# Altium project STM32F407IGH6BGA.PrjPcb
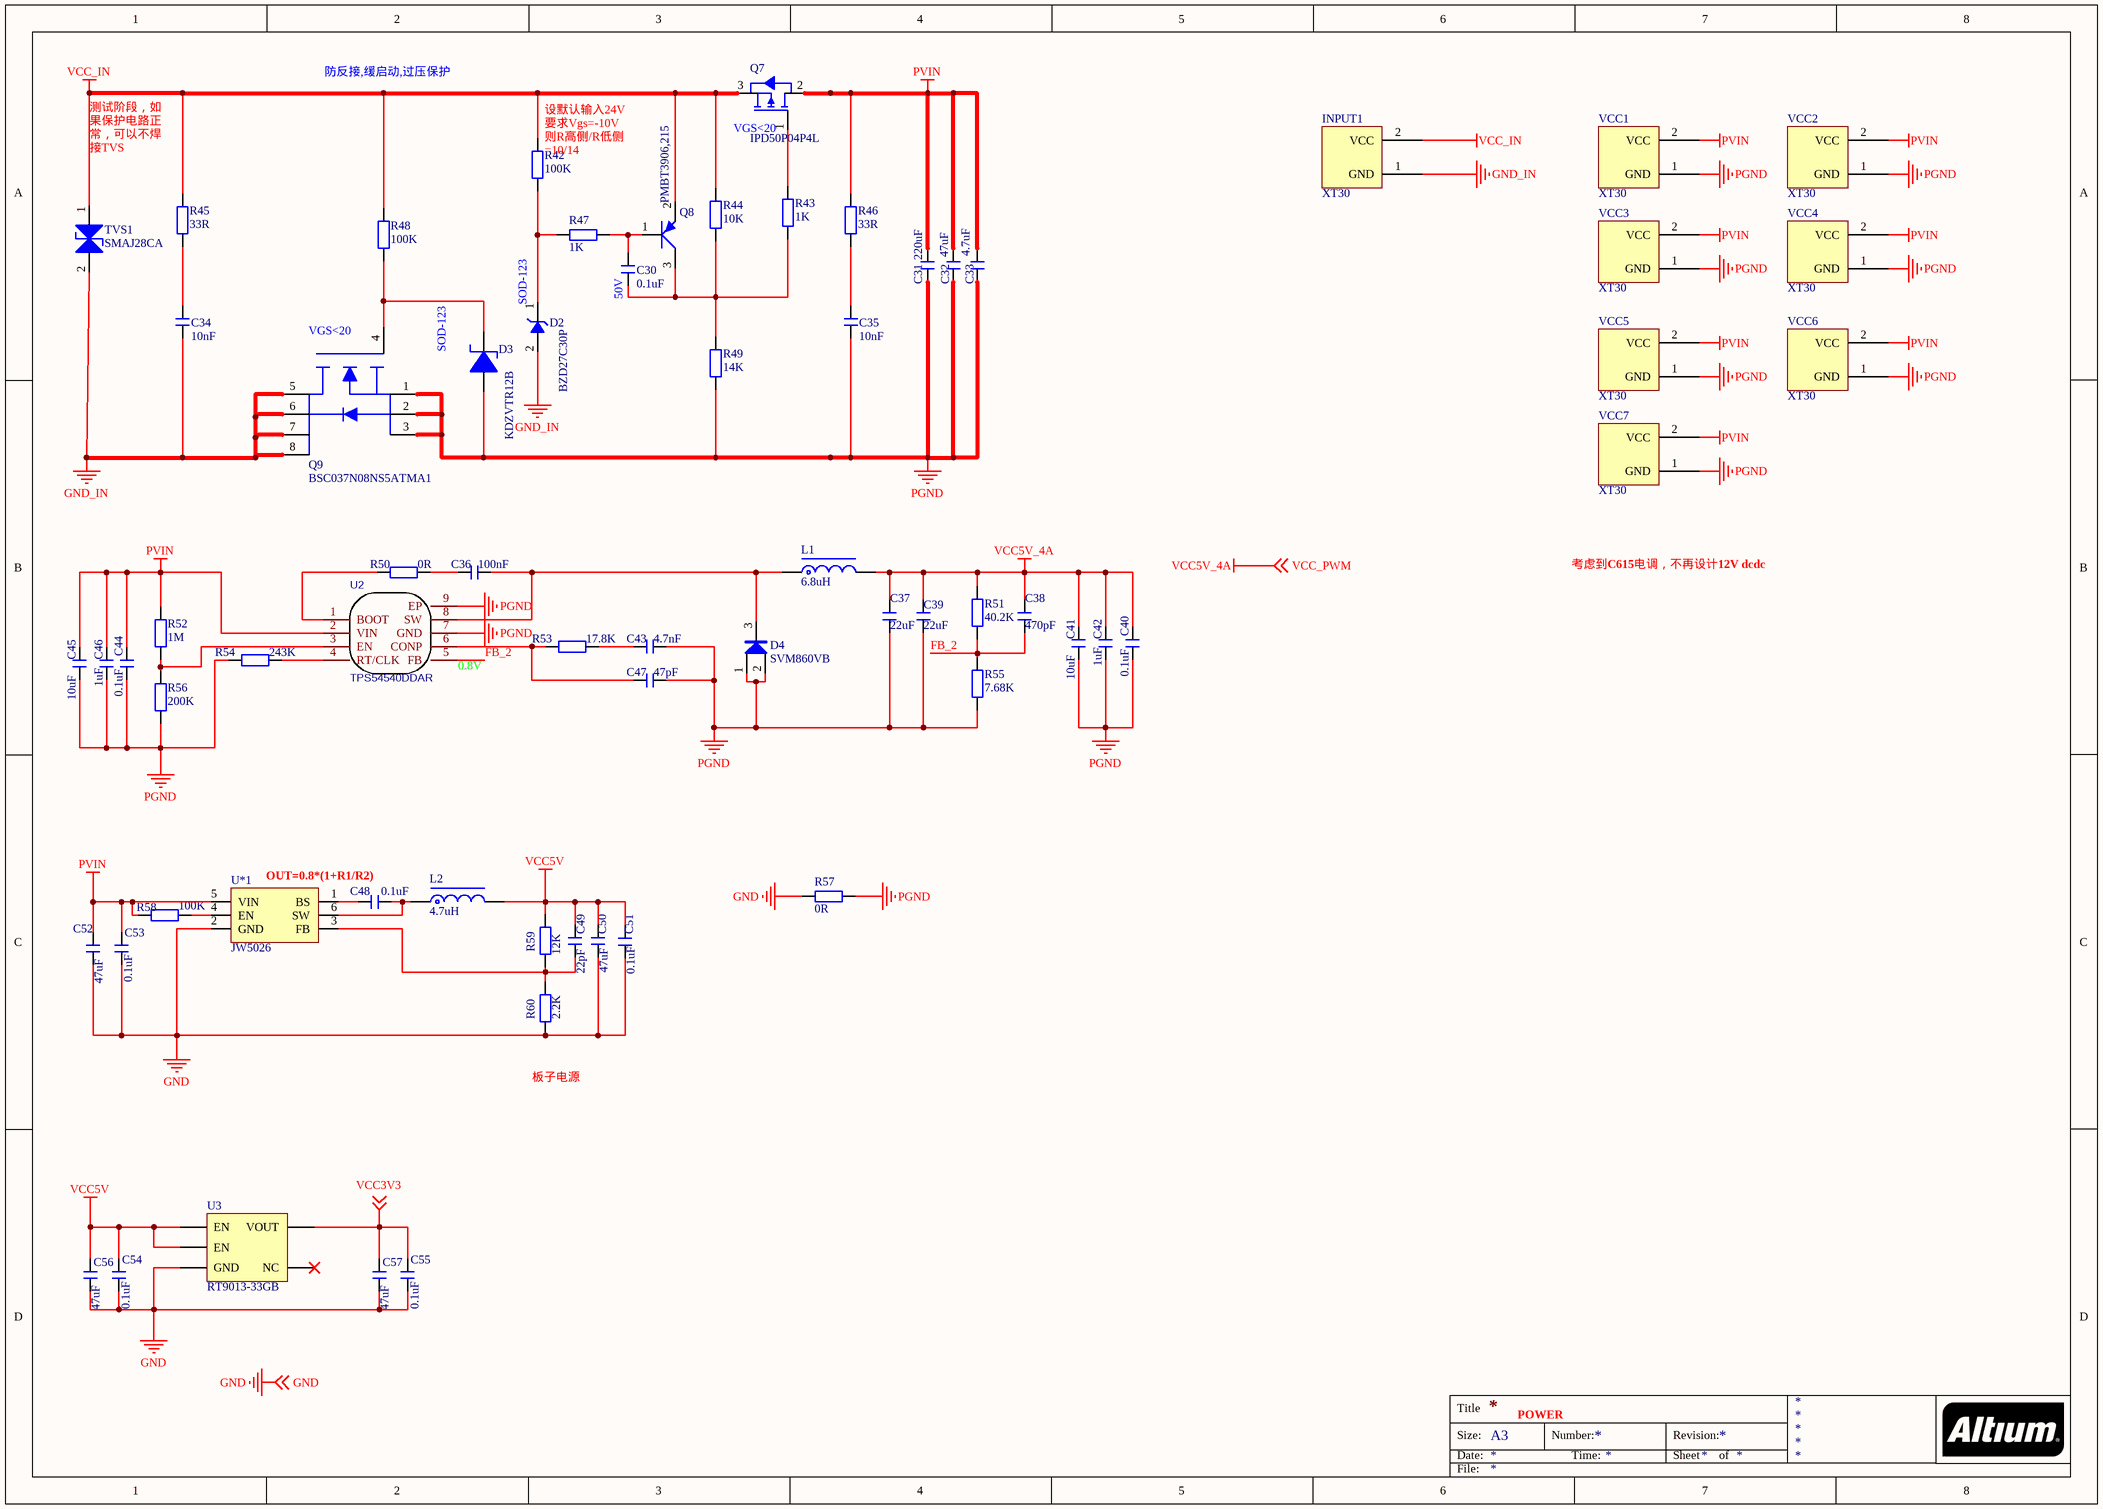
[diagram p0: Power.SchDoc]
3 sheets, 197 parts. Net scope: global (net labels, ports and power ports of the same name join across sheets).
Board file: STM32F407IGH6BGA.PcbDoc
Sheets:
  Power.SchDoc
  STM32F407IGH6BGA.SchDoc
  BasicPeripherals.SchDoc

## Sheet Power.SchDoc
size A3

### Parts
C30  0.1uF  [C 0603_L]
C31  220uF  [C 1206_L]
C32  47uF  [C 1206_L]
C33  4.7uF  [C 1206_L]
C34  10nF  [C 0603_L]
C35  10nF  [C 0603_L]
C36  100nF  [C 0603_L]
C37  22uF  [C 0805_L]
C38  470pF  [C 0603_L]
C39  22uF  [C 0805_L]
C40  0.1uF  [C 0805_L]
C41  10uF  [C 0805_L]
C42  1uF  [C 0805_L]
C43  4.7nF  [C 0603_L]
C44  0.1uF  [C 0805_L]
C45  10uF  [C 0805_L]
C46  1uF  [C 0805_L]
C47  47pF  [C 0603_L]
C48  0.1uF  [C 0603_L]
C49  22pF  [C 0603_L]
C50  47uF  [C 0805_L]
C51  0.1uF  [C 0805_L]
C52  47uF  [C 0805_L]
C53  0.1uF  [C 0805_L]
C54  0.1uF  [C 0805_L]
C55  0.1uF  [C 0805_L]
C56  47uF  [C 0805_L]
C57  47uF  [C 0805_L]
D2  BZD27C30P  [SOD-123_L2.8-W1.8-LS3.7-RD]
D3  KDZVTR12B  [SOD-123_L2.8-W1.8-LS3.7-RD]
D4  SVM860VB  [TO-277B_3P-L6.1-W4.3-LS7.0-BR]
INPUT1  XT30  [XT30PW-M]
L1  6.8uH  [CDRH73]
L2  4.7uH  [CD53]
Q7  IPD50P04P4L  [PG-TO252-3]
Q8  PMBT3906,215  [SOT-23-3_L2.9-W1.3-P1.90-LS2.4-BR]
Q9  BSC037N08NS5ATMA1  [PG-TDSON-8_L5.0-W6.0-P1.27-LS6.2-BL-EP]
R42  100K  [R 0603_L]
R43  1K  [R 0603_L]
R44  10K  [R 0603_L]
R45  33R  [R 0603_L]
R46  33R  [R 0603_L]
R47  1K  [R 0603_L]
R48  100K  [R 0603_L]
R49  14K  [R 0603_L]
R50  0R  [R 0603_L]
R51  40.2K  [R 0603_L]
R52  1M  [R 0603_L]
R53  17.8K  [R 0603_L]
R54  243K  [R 0603_L]
R55  7.68K  [R 0603_L]
R56  200K  [R 0603_L]
R57  0R  [R 0603_L]
R58  100K  [R 0603_L]
R59  12K  [R 0603_L]
R60  2.2K  [R 0603_L]
TVS1  SMAJ28CA  [SMA(DO-214AC)]
U2  TPS54540DDAR  [TPS54540]
U3  RT9013-33GB  [SOT23-5M]
U*1  JW5026  [SOT-23-6_L2.9-W1.6-P0.95-LS2.8-BL]
VCC1  XT30  [XT30UPB-F]
VCC2  XT30  [XT30UPB-F]
VCC3  XT30  [XT30UPB-F]
VCC4  XT30  [XT30UPB-F]
VCC5  XT30  [XT30UPB-F]
VCC6  XT30  [XT30UPB-F]
VCC7  XT30  [XT30UPB-F]

### Nets
GND: C50.1 C51.1 C52.1 C53.1 C54.1 C55.1 C56.1 C57.1 R57.1 R60.1 U3.2(GND) U*1.2(GND) ; off-sheet GND
GND_IN: C34.1 D2.2 INPUT1.1(GND) Q9.5 Q9.6 Q9.7 Q9.8 TVS1.2
PGND: C31.1 C32.1 C33.1 C35.1 C37.1 C39.1 C40.1 C41.1 C42.1 C43.2 C44.1 C45.1 C46.1 C47.2 D3.2 D4.1(A) D4.2(K) Q9.1 Q9.2 Q9.3 R49.1 R54.2 R55.1 R56.1 R57.2 U2.7(GND) U2.9(EP) VCC1.1(GND) VCC2.1(GND) VCC3.1(GND) VCC4.1(GND) VCC5.1(GND) VCC6.1(GND) VCC7.1(GND)
PVIN: C31.2 C32.2 C33.2 C44.2 C45.2 C46.2 C52.2 C53.2 Q7.2 R46.2 R52.2 R58.2 U2.2(VIN) U*1.5(VIN) VCC1.2(VCC) VCC2.2(VCC) VCC3.2(VCC) VCC4.2(VCC) VCC5.2(VCC) VCC6.2(VCC) VCC7.2(VCC)
VCC3V3: C55.2 C57.2 U3.5(VOUT) ; off-sheet VCC3V3
VCC5V: C49.2 C50.2 C51.2 C54.2 C56.2 L2.2 R59.2 U3.1(EN) U3.3(EN)
VCC5V_4A: C37.2 C38.2 C39.2 C40.2 C41.2 C42.2 L1.2 R51.2 ; off-sheet VCC_PWM  [also labelled VCC_PWM]
VCC_IN: INPUT1.2(VCC) Q7.3 Q8.2 R42.2 R44.2 R45.2 R48.2 TVS1.1
FB_2: C38.1 R51.1 R55.2 U2.5(FB)
NetC30_1: C30.1 Q8.3 R43.1 R44.1 R49.2
NetC30_2: C30.2 Q8.1 R47.1
NetC34_2: C34.2 R45.1
NetC35_2: C35.2 R46.1
NetC36_1: C36.1 R50.1
NetC36_2: C36.2 D4.3 L1.1 U2.8(SW)
NetC43_1: C43.1 R53.1
NetC47_1: C47.1 R53.2 U2.6(CONP)
NetC48_1: C48.1 U*1.1(BS)
NetC48_2: C48.2 L2.1 U*1.6(SW)
NetC49_1: C49.1 R59.1 R60.2 U*1.3(FB)
NetD2_1: D2.1 R42.1 R47.2
NetD3_1: D3.1 Q9.4 R48.1
NetQ7_1: Q7.1 R43.2
NetR50_2: R50.2 U2.1(BOOT)
NetR52_1: R52.1 R56.2 U2.3(EN)
NetR54_1: R54.1 U2.4(RT/CLK)
NetR58_1: R58.1 U*1.4(EN)

Not connected (* = marked no-connect by the designer): U3 4(NC)*

### Notes on the sheet
- 防反接,缓启动,过压保护
- 测试阶段，如果保护电路正常，可以不焊接TVS
- (near R42) 设默认输入24V
  要求Vgs=-10V
  则R高侧/R低侧=10/14
- (near Q7) VGS<20
- (near D2) SOD-123
- (near C30) 50V
- (near Q9) VGS<20
- SOD-123
- 考虑到C615电调，不再设计12V dcdc
- (near U2) 0.8V
- OUT=0.8*(1+R1/R2)
- (near R60) 板子电源
- POWER
- Title
- Size:
- Date:
- A3
- Number:
- Time:
- Revision:
- Sheet
- of
- File:

### Library data of the parts
C30-C57 = C: 贴片电容
D4 = SVM860VB: TO-277B系列,SVM860VB-8A
L1 = L-CDRH: 功率屏蔽电感
L2 = L-SMD: CD系列贴片线绕功率电感
R42-R60 = R: 贴片电阻
U2 = TPS54540DDAR: BOM_Manufacturer: TI; SMT Type: Extend; BOM_Supplier: LCSC; BOM_Manufacturer Part: TPS54540DDAR; BOM_Supplier Part: C95286; BOM_LCSC Assembly: Yes; spicePre: U
U*1 = JW5026 : BUCK、MAX40V

## Sheet STM32F407IGH6BGA.SchDoc
size A3
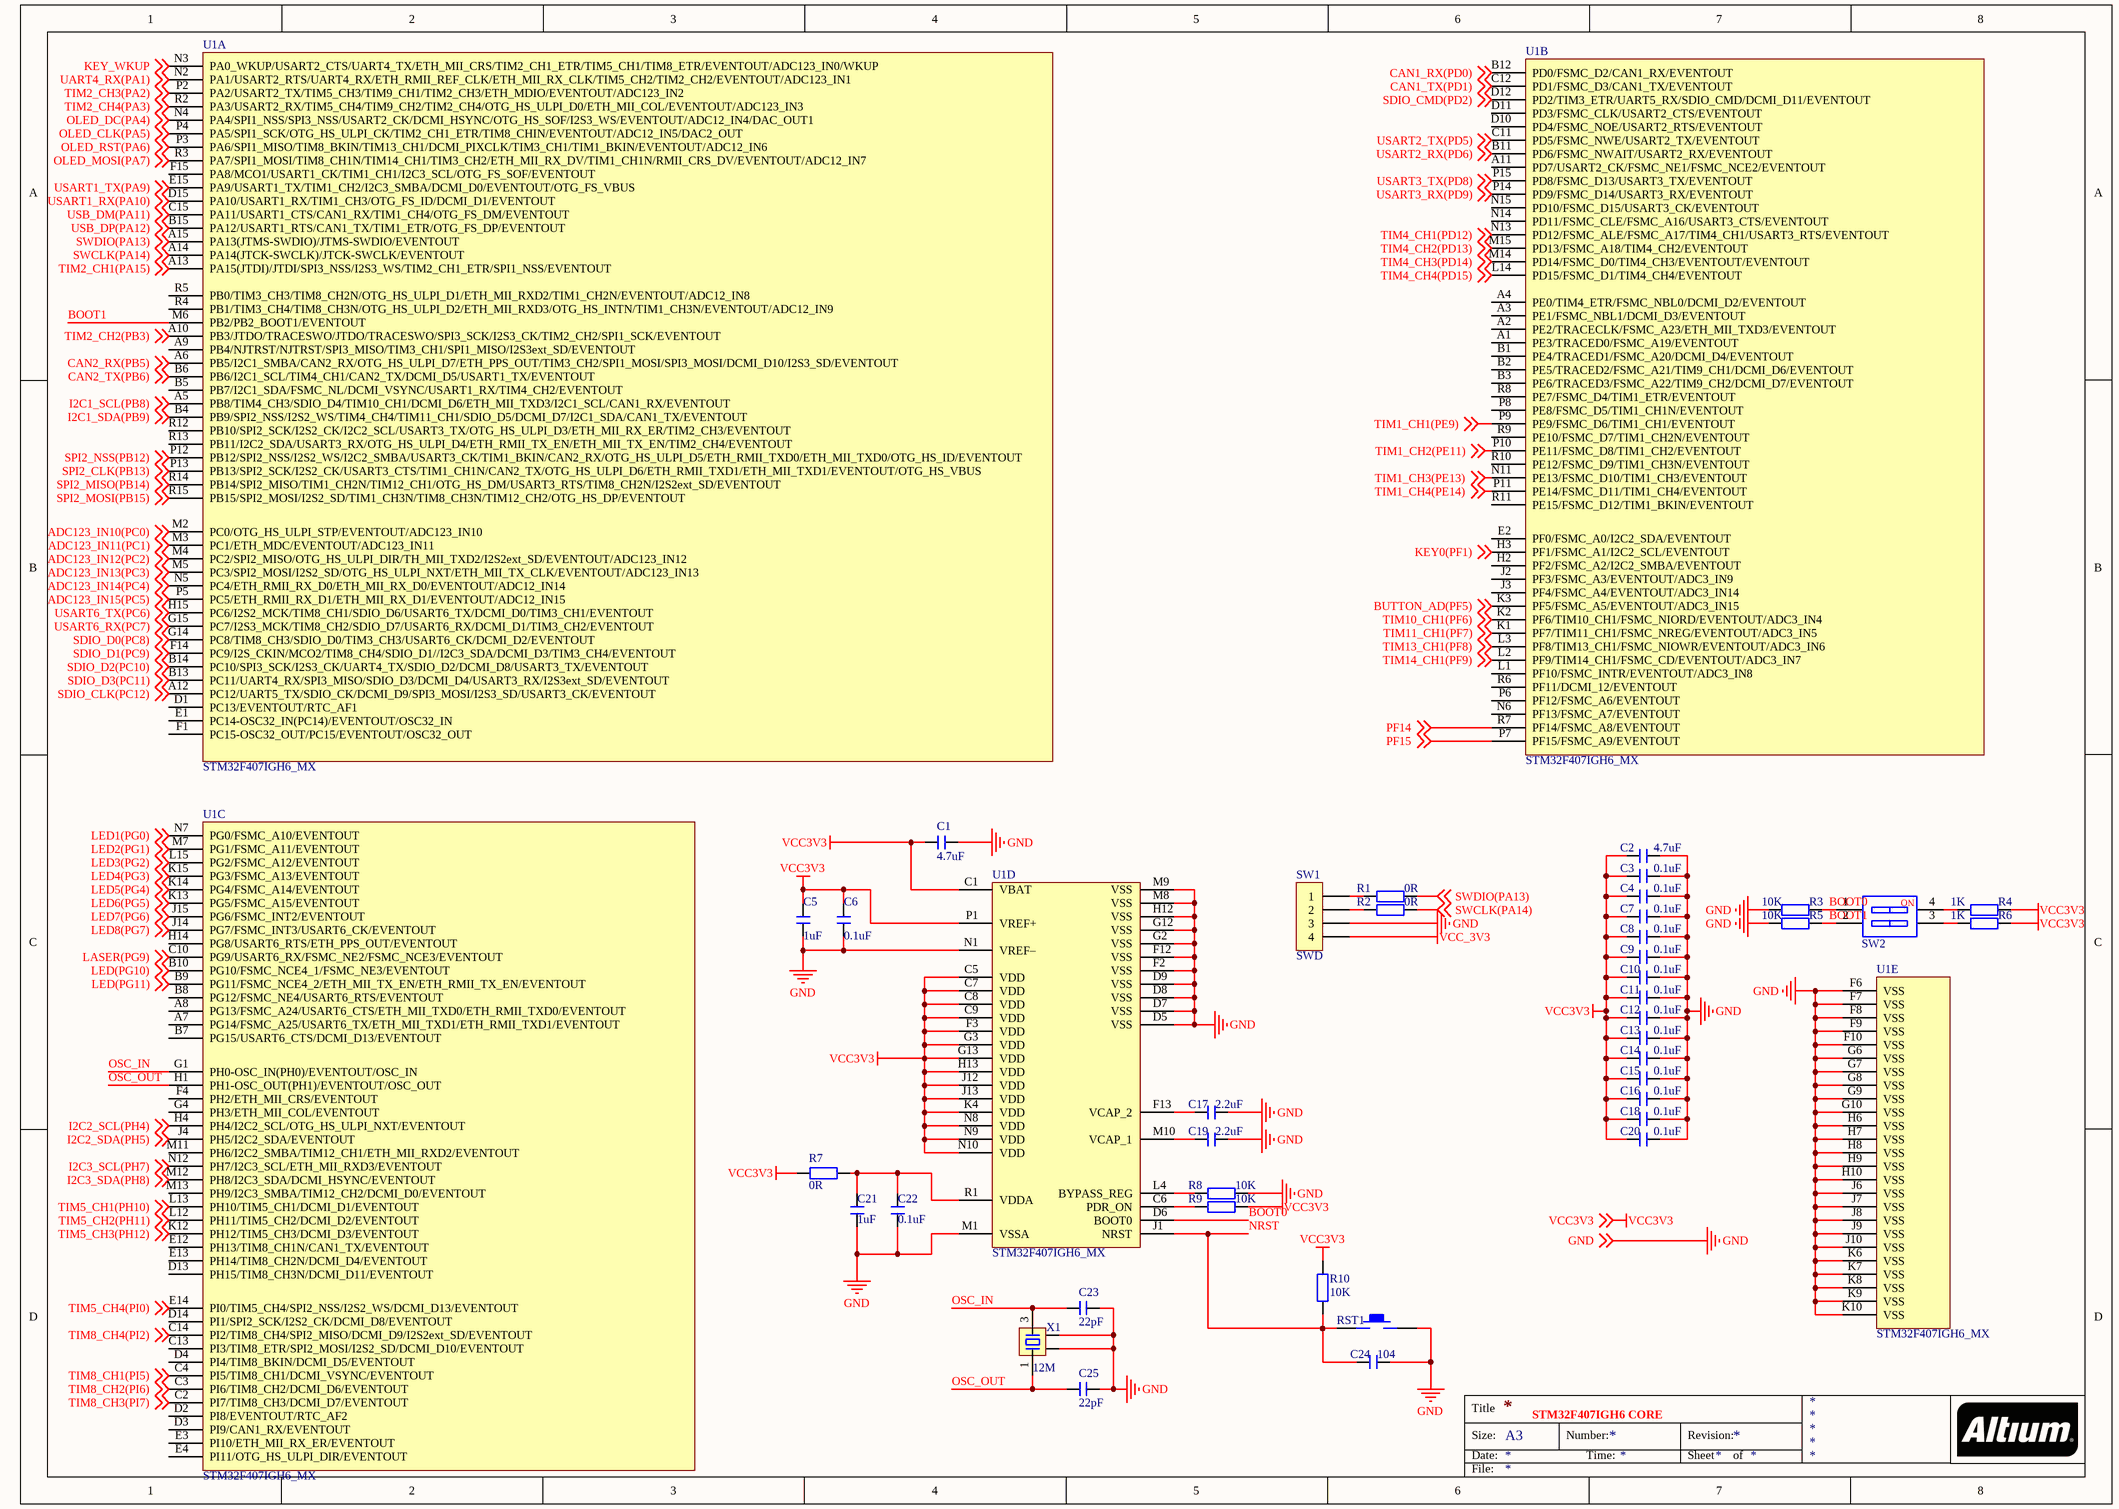
[diagram p1: STM32F407IGH6BGA.SchDoc]

### Parts
C1  4.7uF  [C 0402_M]
C2  4.7uF  [C 0402_M]
C3  0.1uF  [C 0402_M]
C4  0.1uF  [C 0402_M]
C5  1uF  [C 0402_M]
C6  0.1uF  [C 0402_M]
C7  0.1uF  [C 0402_M]
C8  0.1uF  [C 0402_M]
C9  0.1uF  [C 0402_M]
C10  0.1uF  [C 0402_M]
C11  0.1uF  [C 0402_M]
C12  0.1uF  [C 0402_M]
C13  0.1uF  [C 0402_M]
C14  0.1uF  [C 0402_M]
C15  0.1uF  [C 0402_M]
C16  0.1uF  [C 0402_M]
C17  2.2uF  [C 0402_M]
C18  0.1uF  [C 0402_M]
C19  2.2uF  [C 0402_M]
C20  0.1uF  [C 0402_M]
C21  1uF  [C 0402_M]
C22  0.1uF  [C 0402_M]
C23  22pF  [C 0402_M]
C24  104  [C 0402_M]
C25  22pF  [C 0402_M]
R1  0R  [R 0402_M]
R2  0R  [R 0402_M]
R3  10K  [R 0402_M]
R4  1K  [R 0402_M]
R5  10K  [R 0402_M]
R6  1K  [R 0402_M]
R7  0R  [R 0402_M]
R8  10K  [R 0402_M]
R9  10K  [R 0402_M]
R10  10K  [R 0402_M]
RST1  RST  [SMD-3.2*4.2]  (value not drawn)
SW1  SWD  [MX 1.25-WS-4P]
SW2  SW-2P  [CSW1.27 SMD-2P]  (value not drawn)
U1  STM32F407IGH6_MX  [UBGA-176+25]  (parts A,B,C,D,E of 5)
X1  12M  [OSC 3225-4P]

### Nets
GND: C1.1 C2.2 C3.2 C4.2 C5.1 C6.1 C7.2 C8.2 C9.2 C10.2 C11.2 C12.2 C13.2 C14.2 C15.2 C16.2 C17.2 C18.2 C19.2 C20.2 C21.1 C22.1 C23.2 C24.2 C25.2 R3.1 R5.1 R8.2 RST1.2 SW1.3 U1.D5(VSS) U1.D7(VSS) U1.D8(VSS) U1.D9(VSS) U1.F2(VSS) U1.F6(VSS) U1.F7(VSS) U1.F8(VSS) U1.F9(VSS) U1.F10(VSS) U1.F12(VSS) U1.G2(VSS) U1.G6(VSS) U1.G7(VSS) U1.G8(VSS) U1.G9(VSS) U1.G10(VSS) U1.G12(VSS) U1.H6(VSS) U1.H7(VSS) U1.H8(VSS) U1.H9(VSS) U1.H10(VSS) U1.H12(VSS) U1.J6(VSS) U1.J7(VSS) U1.J8(VSS) U1.J9(VSS) U1.J10(VSS) U1.K6(VSS) U1.K7(VSS) U1.K8(VSS) U1.K9(VSS) U1.K10(VSS) U1.M1(VSSA) U1.M8(VSS) U1.M9(VSS) U1.N1(VREF–) X1.2 X1.4 ; off-sheet GND
VCC3V3: C1.2 C2.1 C3.1 C4.1 C5.2 C6.2 C7.1 C8.1 C9.1 C10.1 C11.1 C12.1 C13.1 C14.1 C15.1 C16.1 C18.1 C20.1 R4.2 R6.2 R7.1 R9.2 R10.2 U1.C1(VBAT) U1.C5(VDD) U1.C7(VDD) U1.C8(VDD) U1.C9(VDD) U1.F3(VDD) U1.G3(VDD) U1.G13(VDD) U1.H13(VDD) U1.J12(VDD) U1.J13(VDD) U1.K4(VDD) U1.N8(VDD) U1.N9(VDD) U1.N10(VDD) U1.P1(VREF+) ; off-sheet VCC3V3
VCC_3V3: SW1.4
ADC123_IN10(PC0): U1.M2(PC0/OTG_HS_ULPI_STP/EVENTOUT/ADC123_IN10) ; off-sheet ADC123_IN10(PC0)
ADC123_IN11(PC1): U1.M3(PC1/ETH_MDC/EVENTOUT/ADC123_IN11) ; off-sheet ADC123_IN11(PC1)
ADC123_IN12(PC2): U1.M4(PC2/SPI2_MISO/OTG_HS_ULPI_DIR/TH_MII_TXD2/I2S2ext_SD/EVENTOUT/ADC123_IN12) ; off-sheet ADC123_IN12(PC2)
ADC123_IN13(PC3): U1.M5(PC3/SPI2_MOSI/I2S2_SD/OTG_HS_ULPI_NXT/ETH_MII_TX_CLK/EVENTOUT/ADC123_IN13) ; off-sheet ADC123_IN13(PC3)
ADC123_IN14(PC4): U1.N5(PC4/ETH_RMII_RX_D0/ETH_MII_RX_D0/EVENTOUT/ADC12_IN14) ; off-sheet ADC123_IN14(PC4)
ADC123_IN15(PC5): U1.P5(PC5/ETH_RMII_RX_D1/ETH_MII_RX_D1/EVENTOUT/ADC12_IN15) ; off-sheet ADC123_IN15(PC5)
BOOT0: R3.2 SW2.1 U1.D6(BOOT0)
BOOT1: R5.2 SW2.2 U1.M6(PB2/PB2_BOOT1/EVENTOUT)
BUTTON_AD(PF5): U1.K3(PF5/FSMC_A5/EVENTOUT/ADC3_IN15) ; off-sheet BUTTON_AD(PF5)
CAN1_RX(PD0): U1.B12(PD0/FSMC_D2/CAN1_RX/EVENTOUT) ; off-sheet CAN1_RX(PD0)
CAN1_TX(PD1): U1.C12(PD1/FSMC_D3/CAN1_TX/EVENTOUT) ; off-sheet CAN1_TX(PD1)
CAN2_RX(PB5): U1.A6(PB5/I2C1_SMBA/CAN2_RX/OTG_HS_ULPI_D7/ETH_PPS_OUT/TIM3_CH2/SPI1_MOSI/SPI3_MOSI/DCMI_D10/I2S3_SD/EVENTOUT) ; off-sheet CAN2_RX(PB5)
CAN2_TX(PB6): U1.B6(PB6/I2C1_SCL/TIM4_CH1/CAN2_TX/DCMI_D5/USART1_TX/EVENTOUT) ; off-sheet CAN2_TX(PB6)
I2C1_SCL(PB8): U1.A5(PB8/TIM4_CH3/SDIO_D4/TIM10_CH1/DCMI_D6/ETH_MII_TXD3/I2C1_SCL/CAN1_RX/EVENTOUT) ; off-sheet I2C1_SCL(PB8)
I2C1_SDA(PB9): U1.B4(PB9/SPI2_NSS/I2S2_WS/TIM4_CH4/TIM11_CH1/SDIO_D5/DCMI_D7/I2C1_SDA/CAN1_TX/EVENTOUT) ; off-sheet I2C1_SDA(PB9)
I2C2_SCL(PH4): U1.H4(PH4/I2C2_SCL/OTG_HS_ULPI_NXT/EVENTOUT) ; off-sheet I2C2_SCL(PH4)
I2C2_SDA(PH5): U1.J4(PH5/I2C2_SDA/EVENTOUT) ; off-sheet I2C2_SDA(PH5)
I2C3_SCL(PH7): U1.N12(PH7/I2C3_SCL/ETH_MII_RXD3/EVENTOUT) ; off-sheet I2C3_SCL(PH7)
I2C3_SDA(PH8): U1.M12(PH8/I2C3_SDA/DCMI_HSYNC/EVENTOUT) ; off-sheet I2C3_SDA(PH8)
KEY0(PF1): U1.H3(PF1/FSMC_A1/I2C2_SCL/EVENTOUT) ; off-sheet KEY0(PF1)
KEY_WKUP: U1.N3(PA0_WKUP/USART2_CTS/UART4_TX/ETH_MII_CRS/TIM2_CH1_ETR/TIM5_CH1/TIM8_ETR/EVENTOUT/ADC123_IN0/WKUP) ; off-sheet KEY_WKUP
LASER(PG9): U1.C10(PG9/USART6_RX/FSMC_NE2/FSMC_NCE3/EVENTOUT) ; off-sheet LASER(PG9)
LED1(PG0): U1.N7(PG0/FSMC_A10/EVENTOUT) ; off-sheet LED1(PG0)
LED2(PG1): U1.M7(PG1/FSMC_A11/EVENTOUT) ; off-sheet LED2(PG1)
LED3(PG2): U1.L15(PG2/FSMC_A12/EVENTOUT) ; off-sheet LED3(PG2)
LED4(PG3): U1.K15(PG3/FSMC_A13/EVENTOUT) ; off-sheet LED4(PG3)
LED5(PG4): U1.K14(PG4/FSMC_A14/EVENTOUT) ; off-sheet LED5(PG4)
LED6(PG5): U1.K13(PG5/FSMC_A15/EVENTOUT) ; off-sheet LED6(PG5)
LED7(PG6): U1.J15(PG6/FSMC_INT2/EVENTOUT) ; off-sheet LED7(PG6)
LED8(PG7): U1.J14(PG7/FSMC_INT3/USART6_CK/EVENTOUT) ; off-sheet LED8(PG7)
LED(PG10): U1.B10(PG10/FSMC_NCE4_1/FSMC_NE3/EVENTOUT) ; off-sheet LED(PG10)
LED(PG11): U1.B9(PG11/FSMC_NCE4_2/ETH_MII_TX_EN/ETH_RMII_TX_EN/EVENTOUT) ; off-sheet LED(PG11)
NRST: C24.1 R10.1 RST1.1 U1.J1(NRST)
OLED_CLK(PA5): U1.P4(PA5/SPI1_SCK/OTG_HS_ULPI_CK/TIM2_CH1_ETR/TIM8_CHIN/EVENTOUT/ADC12_IN5/DAC2_OUT) ; off-sheet OLED_CLK(PA5)
OLED_DC(PA4): U1.N4(PA4/SPI1_NSS/SPI3_NSS/USART2_CK/DCMI_HSYNC/OTG_HS_SOF/I2S3_WS/EVENTOUT/ADC12_IN4/DAC_OUT1) ; off-sheet OLED_DC(PA4)
OLED_MOSI(PA7): U1.R3(PA7/SPI1_MOSI/TIM8_CH1N/TIM14_CH1/TIM3_CH2/ETH_MII_RX_DV/TIM1_CH1N/RMII_CRS_DV/EVENTOUT/ADC12_IN7) ; off-sheet OLED_MOSI(PA7)
OLED_RST(PA6): U1.P3(PA6/SPI1_MISO/TIM8_BKIN/TIM13_CH1/DCMI_PIXCLK/TIM3_CH1/TIM1_BKIN/EVENTOUT/ADC12_IN6) ; off-sheet OLED_RST(PA6)
OSC_IN: C23.1 U1.G1(PH0-OSC_IN(PH0)/EVENTOUT/OSC_IN) X1.3
OSC_OUT: C25.1 U1.H1(PH1-OSC_OUT(PH1)/EVENTOUT/OSC_OUT) X1.1
PF14: U1.R7(PF14/FSMC_A8/EVENTOUT) ; off-sheet PF14
PF15: U1.P7(PF15/FSMC_A9/EVENTOUT) ; off-sheet PF15
SDIO_CLK(PC12): U1.A12(PC12/UART5_TX/SDIO_CK/DCMI_D9/SPI3_MOSI/I2S3_SD/USART3_CK/EVENTOUT) ; off-sheet SDIO_CLK(PC12)
SDIO_CMD(PD2): U1.D12(PD2/TIM3_ETR/UART5_RX/SDIO_CMD/DCMI_D11/EVENTOUT) ; off-sheet SDIO_CMD(PD2)
SDIO_D0(PC8): U1.G14(PC8/TIM8_CH3/SDIO_D0/TIM3_CH3/USART6_CK/DCMI_D2/EVENTOUT) ; off-sheet SDIO_D0(PC8)
SDIO_D1(PC9): U1.F14(PC9/I2S_CKIN/MCO2/TIM8_CH4/SDIO_D1//I2C3_SDA/DCMI_D3/TIM3_CH4/EVENTOUT) ; off-sheet SDIO_D1(PC9)
SDIO_D2(PC10): U1.B14(PC10/SPI3_SCK/I2S3_CK/UART4_TX/SDIO_D2/DCMI_D8/USART3_TX/EVENTOUT) ; off-sheet SDIO_D2(PC10)
SDIO_D3(PC11): U1.B13(PC11/UART4_RX/SPI3_MISO/SDIO_D3/DCMI_D4/USART3_RX/I2S3ext_SD/EVENTOUT) ; off-sheet SDIO_D3(PC11)
SPI2_CLK(PB13): U1.P13(PB13/SPI2_SCK/I2S2_CK/USART3_CTS/TIM1_CH1N/CAN2_TX/OTG_HS_ULPI_D6/ETH_RMII_TXD1/ETH_MII_TXD1/EVENTOUT/OTG_HS_VBUS) ; off-sheet SPI2_CLK(PB13)
SPI2_MISO(PB14): U1.R14(PB14/SPI2_MISO/TIM1_CH2N/TIM12_CH1/OTG_HS_DM/USART3_RTS/TIM8_CH2N/I2S2ext_SD/EVENTOUT) ; off-sheet SPI2_MISO(PB14)
SPI2_MOSI(PB15): U1.R15(PB15/SPI2_MOSI/I2S2_SD/TIM1_CH3N/TIM8_CH3N/TIM12_CH2/OTG_HS_DP/EVENTOUT) ; off-sheet SPI2_MOSI(PB15)
SPI2_NSS(PB12): U1.P12(PB12/SPI2_NSS/I2S2_WS/I2C2_SMBA/USART3_CK/TIM1_BKIN/CAN2_RX/OTG_HS_ULPI_D5/ETH_RMII_TXD0/ETH_MII_TXD0/OTG_HS_ID/EVENTOUT) ; off-sheet SPI2_NSS(PB12)
SWCLK(PA14): R2.2 U1.A14(PA14(JTCK-SWCLK)/JTCK-SWCLK/EVENTOUT) ; off-sheet SWCLK(PA14)
SWDIO(PA13): R1.2 U1.A15(PA13(JTMS-SWDIO)/JTMS-SWDIO/EVENTOUT) ; off-sheet SWDIO(PA13)
TIM1_CH1(PE9): U1.P9(PE9/FSMC_D6/TIM1_CH1/EVENTOUT) ; off-sheet TIM1_CH1(PE9)
TIM1_CH2(PE11): U1.P10(PE11/FSMC_D8/TIM1_CH2/EVENTOUT) ; off-sheet TIM1_CH2(PE11)
TIM1_CH3(PE13): U1.N11(PE13/FSMC_D10/TIM1_CH3/EVENTOUT) ; off-sheet TIM1_CH3(PE13)
TIM1_CH4(PE14): U1.P11(PE14/FSMC_D11/TIM1_CH4/EVENTOUT) ; off-sheet TIM1_CH4(PE14)
TIM2_CH1(PA15): U1.A13(PA15(JTDI)/JTDI/SPI3_NSS/I2S3_WS/TIM2_CH1_ETR/SPI1_NSS/EVENTOUT) ; off-sheet TIM2_CH1(PA15)
TIM2_CH2(PB3): U1.A10(PB3/JTDO/TRACESWO/JTDO/TRACESWO/SPI3_SCK/I2S3_CK/TIM2_CH2/SPI1_SCK/EVENTOUT) ; off-sheet TIM2_CH2(PB3)
TIM2_CH3(PA2): U1.P2(PA2/USART2_TX/TIM5_CH3/TIM9_CH1/TIM2_CH3/ETH_MDIO/EVENTOUT/ADC123_IN2) ; off-sheet TIM2_CH3(PA2)
TIM2_CH4(PA3): U1.R2(PA3/USART2_RX/TIM5_CH4/TIM9_CH2/TIM2_CH4/OTG_HS_ULPI_D0/ETH_MII_COL/EVENTOUT/ADC123_IN3) ; off-sheet TIM2_CH4(PA3)
TIM4_CH1(PD12): U1.N13(PD12/FSMC_ALE/FSMC_A17/TIM4_CH1/USART3_RTS/EVENTOUT) ; off-sheet TIM4_CH1(PD12)
TIM4_CH2(PD13): U1.M15(PD13/FSMC_A18/TIM4_CH2/EVENTOUT) ; off-sheet TIM4_CH2(PD13)
TIM4_CH3(PD14): U1.M14(PD14/FSMC_D0/TIM4_CH3/EVENTOUT/EVENTOUT) ; off-sheet TIM4_CH3(PD14)
TIM4_CH4(PD15): U1.L14(PD15/FSMC_D1/TIM4_CH4/EVENTOUT) ; off-sheet TIM4_CH4(PD15)
TIM5_CH1(PH10): U1.L13(PH10/TIM5_CH1/DCMI_D1/EVENTOUT) ; off-sheet TIM5_CH1(PH10)
TIM5_CH2(PH11): U1.L12(PH11/TIM5_CH2/DCMI_D2/EVENTOUT) ; off-sheet TIM5_CH2(PH11)
TIM5_CH3(PH12): U1.K12(PH12/TIM5_CH3/DCMI_D3/EVENTOUT) ; off-sheet TIM5_CH3(PH12)
TIM5_CH4(PI0): U1.E14(PI0/TIM5_CH4/SPI2_NSS/I2S2_WS/DCMI_D13/EVENTOUT) ; off-sheet TIM5_CH4(PI0)
TIM8_CH1(PI5): U1.C4(PI5/TIM8_CH1/DCMI_VSYNC/EVENTOUT) ; off-sheet TIM8_CH1(PI5)
TIM8_CH2(PI6): U1.C3(PI6/TIM8_CH2/DCMI_D6/EVENTOUT) ; off-sheet TIM8_CH2(PI6)
TIM8_CH3(PI7): U1.C2(PI7/TIM8_CH3/DCMI_D7/EVENTOUT) ; off-sheet TIM8_CH3(PI7)
TIM8_CH4(PI2): U1.C14(PI2/TIM8_CH4/SPI2_MISO/DCMI_D9/I2S2ext_SD/EVENTOUT) ; off-sheet TIM8_CH4(PI2)
TIM10_CH1(PF6): U1.K2(PF6/TIM10_CH1/FSMC_NIORD/EVENTOUT/ADC3_IN4) ; off-sheet TIM10_CH1(PF6)
TIM11_CH1(PF7): U1.K1(PF7/TIM11_CH1/FSMC_NREG/EVENTOUT/ADC3_IN5) ; off-sheet TIM11_CH1(PF7)
TIM13_CH1(PF8): U1.L3(PF8/TIM13_CH1/FSMC_NIOWR/EVENTOUT/ADC3_IN6) ; off-sheet TIM13_CH1(PF8)
TIM14_CH1(PF9): U1.L2(PF9/TIM14_CH1/FSMC_CD/EVENTOUT/ADC3_IN7) ; off-sheet TIM14_CH1(PF9)
UART4_RX(PA1): U1.N2(PA1/USART2_RTS/UART4_RX/ETH_RMII_REF_CLK/ETH_MII_RX_CLK/TIM5_CH2/TIM2_CH2/EVENTOUT/ADC123_IN1) ; off-sheet UART4_RX(PA1)
USART1_RX(PA10): U1.D15(PA10/USART1_RX/TIM1_CH3/OTG_FS_ID/DCMI_D1/EVENTOUT) ; off-sheet USART1_RX(PA10)
USART1_TX(PA9): U1.E15(PA9/USART1_TX/TIM1_CH2/I2C3_SMBA/DCMI_D0/EVENTOUT/OTG_FS_VBUS) ; off-sheet USART1_TX(PA9)
USART2_RX(PD6): U1.B11(PD6/FSMC_NWAIT/USART2_RX/EVENTOUT) ; off-sheet USART2_RX(PD6)
USART2_TX(PD5): U1.C11(PD5/FSMC_NWE/USART2_TX/EVENTOUT) ; off-sheet USART2_TX(PD5)
USART3_RX(PD9): U1.P14(PD9/FSMC_D14/USART3_RX/EVENTOUT) ; off-sheet USART3_RX(PD9)
USART3_TX(PD8): U1.P15(PD8/FSMC_D13/USART3_TX/EVENTOUT) ; off-sheet USART3_TX(PD8)
USART6_RX(PC7): U1.G15(PC7/I2S3_MCK/TIM8_CH2/SDIO_D7/USART6_RX/DCMI_D1/TIM3_CH2/EVENTOUT) ; off-sheet USART6_RX(PC7)
USART6_TX(PC6): U1.H15(PC6/I2S2_MCK/TIM8_CH1/SDIO_D6/USART6_TX/DCMI_D0/TIM3_CH1/EVENTOUT) ; off-sheet USART6_TX(PC6)
USB_DM(PA11): U1.C15(PA11/USART1_CTS/CAN1_RX/TIM1_CH4/OTG_FS_DM/EVENTOUT) ; off-sheet USB_DM(PA11)
USB_DP(PA12): U1.B15(PA12/USART1_RTS/CAN1_TX/TIM1_ETR/OTG_FS_DP/EVENTOUT) ; off-sheet USB_DP(PA12)
NetC17_1: C17.1 U1.F13(VCAP_2)
NetC19_1: C19.1 U1.M10(VCAP_1)
NetC21_2: C21.2 C22.2 R7.2 U1.R1(VDDA)
NetR1_1: R1.1 SW1.1
NetR2_1: R2.1 SW1.2
NetR4_1: R4.1 SW2.4
NetR6_1: R6.1 SW2.3
NetR8_1: R8.1 U1.L4(BYPASS_REG)
NetR9_1: R9.1 U1.C6(PDR_ON)

Not connected (* = marked no-connect by the designer): U1 A1(PE3/TRACED0/FSMC_A19/EVENTOUT) A2(PE2/TRACECLK/FSMC_A23/ETH_MII_TXD3/EVENTOUT) A3(PE1/FSMC_NBL1/DCMI_D3/EVENTOUT) A4(PE0/TIM4_ETR/FSMC_NBL0/DCMI_D2/EVENTOUT) A7(PG14/FSMC_A25/USART6_TX/ETH_MII_TXD1/ETH_RMII_TXD1/EVENTOUT) A8(PG13/FSMC_A24/USART6_CTS/ETH_MII_TXD0/ETH_RMII_TXD0/EVENTOUT) A9(PB4/NJTRST/NJTRST/SPI3_MISO/TIM3_CH1/SPI1_MISO/I2S3ext_SD/EVENTOUT) A11(PD7/USART2_CK/FSMC_NE1/FSMC_NCE2/EVENTOUT) B1(PE4/TRACED1/FSMC_A20/DCMI_D4/EVENTOUT) B2(PE5/TRACED2/FSMC_A21/TIM9_CH1/DCMI_D6/EVENTOUT) B3(PE6/TRACED3/FSMC_A22/TIM9_CH2/DCMI_D7/EVENTOUT) B5(PB7/I2C1_SDA/FSMC_NL/DCMI_VSYNC/USART1_RX/TIM4_CH2/EVENTOUT) B7(PG15/USART6_CTS/DCMI_D13/EVENTOUT) B8(PG12/FSMC_NE4/USART6_RTS/EVENTOUT) C13(PI3/TIM8_ETR/SPI2_MOSI/I2S2_SD/DCMI_D10/EVENTOUT) D1(PC13/EVENTOUT/RTC_AF1) D2(PI8/EVENTOUT/RTC_AF2) D3(PI9/CAN1_RX/EVENTOUT) D4(PI4/TIM8_BKIN/DCMI_D5/EVENTOUT) D10(PD4/FSMC_NOE/USART2_RTS/EVENTOUT) D11(PD3/FSMC_CLK/USART2_CTS/EVENTOUT) D13(PH15/TIM8_CH3N/DCMI_D11/EVENTOUT) D14(PI1/SPI2_SCK/I2S2_CK/DCMI_D8/EVENTOUT) E1(PC14-OSC32_IN(PC14)/EVENTOUT/OSC32_IN) E2(PF0/FSMC_A0/I2C2_SDA/EVENTOUT) E3(PI10/ETH_MII_RX_ER/EVENTOUT) E4(PI11/OTG_HS_ULPI_DIR/EVENTOUT) E12(PH13/TIM8_CH1N/CAN1_TX/EVENTOUT) E13(PH14/TIM8_CH2N/DCMI_D4/EVENTOUT) F1(PC15-OSC32_OUT/PC15/EVENTOUT/OSC32_OUT) F4(PH2/ETH_MII_CRS/EVENTOUT) F15(PA8/MCO1/USART1_CK/TIM1_CH1/I2C3_SCL/OTG_FS_SOF/EVENTOUT) G4(PH3/ETH_MII_COL/EVENTOUT) H2(PF2/FSMC_A2/I2C2_SMBA/EVENTOUT) H14(PG8/USART6_RTS/ETH_PPS_OUT/EVENTOUT) J2(PF3/FSMC_A3/EVENTOUT/ADC3_IN9) J3(PF4/FSMC_A4/EVENTOUT/ADC3_IN14) L1(PF10/FSMC_INTR/EVENTOUT/ADC3_IN8) M11(PH6/I2C2_SMBA/TIM12_CH1/ETH_MII_RXD2/EVENTOUT) M13(PH9/I2C3_SMBA/TIM12_CH2/DCMI_D0/EVENTOUT) N6(PF13/FSMC_A7/EVENTOUT) N14(PD11/FSMC_CLE/FSMC_A16/USART3_CTS/EVENTOUT) N15(PD10/FSMC_D15/USART3_CK/EVENTOUT) P6(PF12/FSMC_A6/EVENTOUT) P8(PE8/FSMC_D5/TIM1_CH1N/EVENTOUT) R4(PB1/TIM3_CH4/TIM8_CH3N/OTG_HS_ULPI_D2/ETH_MII_RXD3/OTG_HS_INTN/TIM1_CH3N/EVENTOUT/ADC12_IN9) R5(PB0/TIM3_CH3/TIM8_CH2N/OTG_HS_ULPI_D1/ETH_MII_RXD2/TIM1_CH2N/EVENTOUT/ADC12_IN8) R6(PF11/DCMI_12/EVENTOUT) R8(PE7/FSMC_D4/TIM1_ETR/EVENTOUT) R9(PE10/FSMC_D7/TIM1_CH2N/EVENTOUT) R10(PE12/FSMC_D9/TIM1_CH3N/EVENTOUT) R11(PE15/FSMC_D12/TIM1_BKIN/EVENTOUT) R12(PB10/SPI2_SCK/I2S2_CK/I2C2_SCL/USART3_TX/OTG_HS_ULPI_D3/ETH_MII_RX_ER/TIM2_CH3/EVENTOUT) R13(PB11/I2C2_SDA/USART3_RX/OTG_HS_ULPI_D4/ETH_RMII_TX_EN/ETH_MII_TX_EN/TIM2_CH4/EVENTOUT)

### Notes on the sheet
- STM32F407IGH6 CORE
- Title
- Size:
- Date:
- A3
- Number:
- Time:
- Revision:
- Sheet
- of
- File:
- (in symbol SW-2P) NO

### Library data of the parts
C1-C25 = C: 贴片电容
R1-R10 = R: 贴片电阻
RST1 = KEY_M
SW1 = HDR1x4: Connector
SW2 = SW-2P: 2路编码开关
X1 = XTAL-4P: 4脚无源晶振

## Sheet BasicPeripherals.SchDoc
size A3
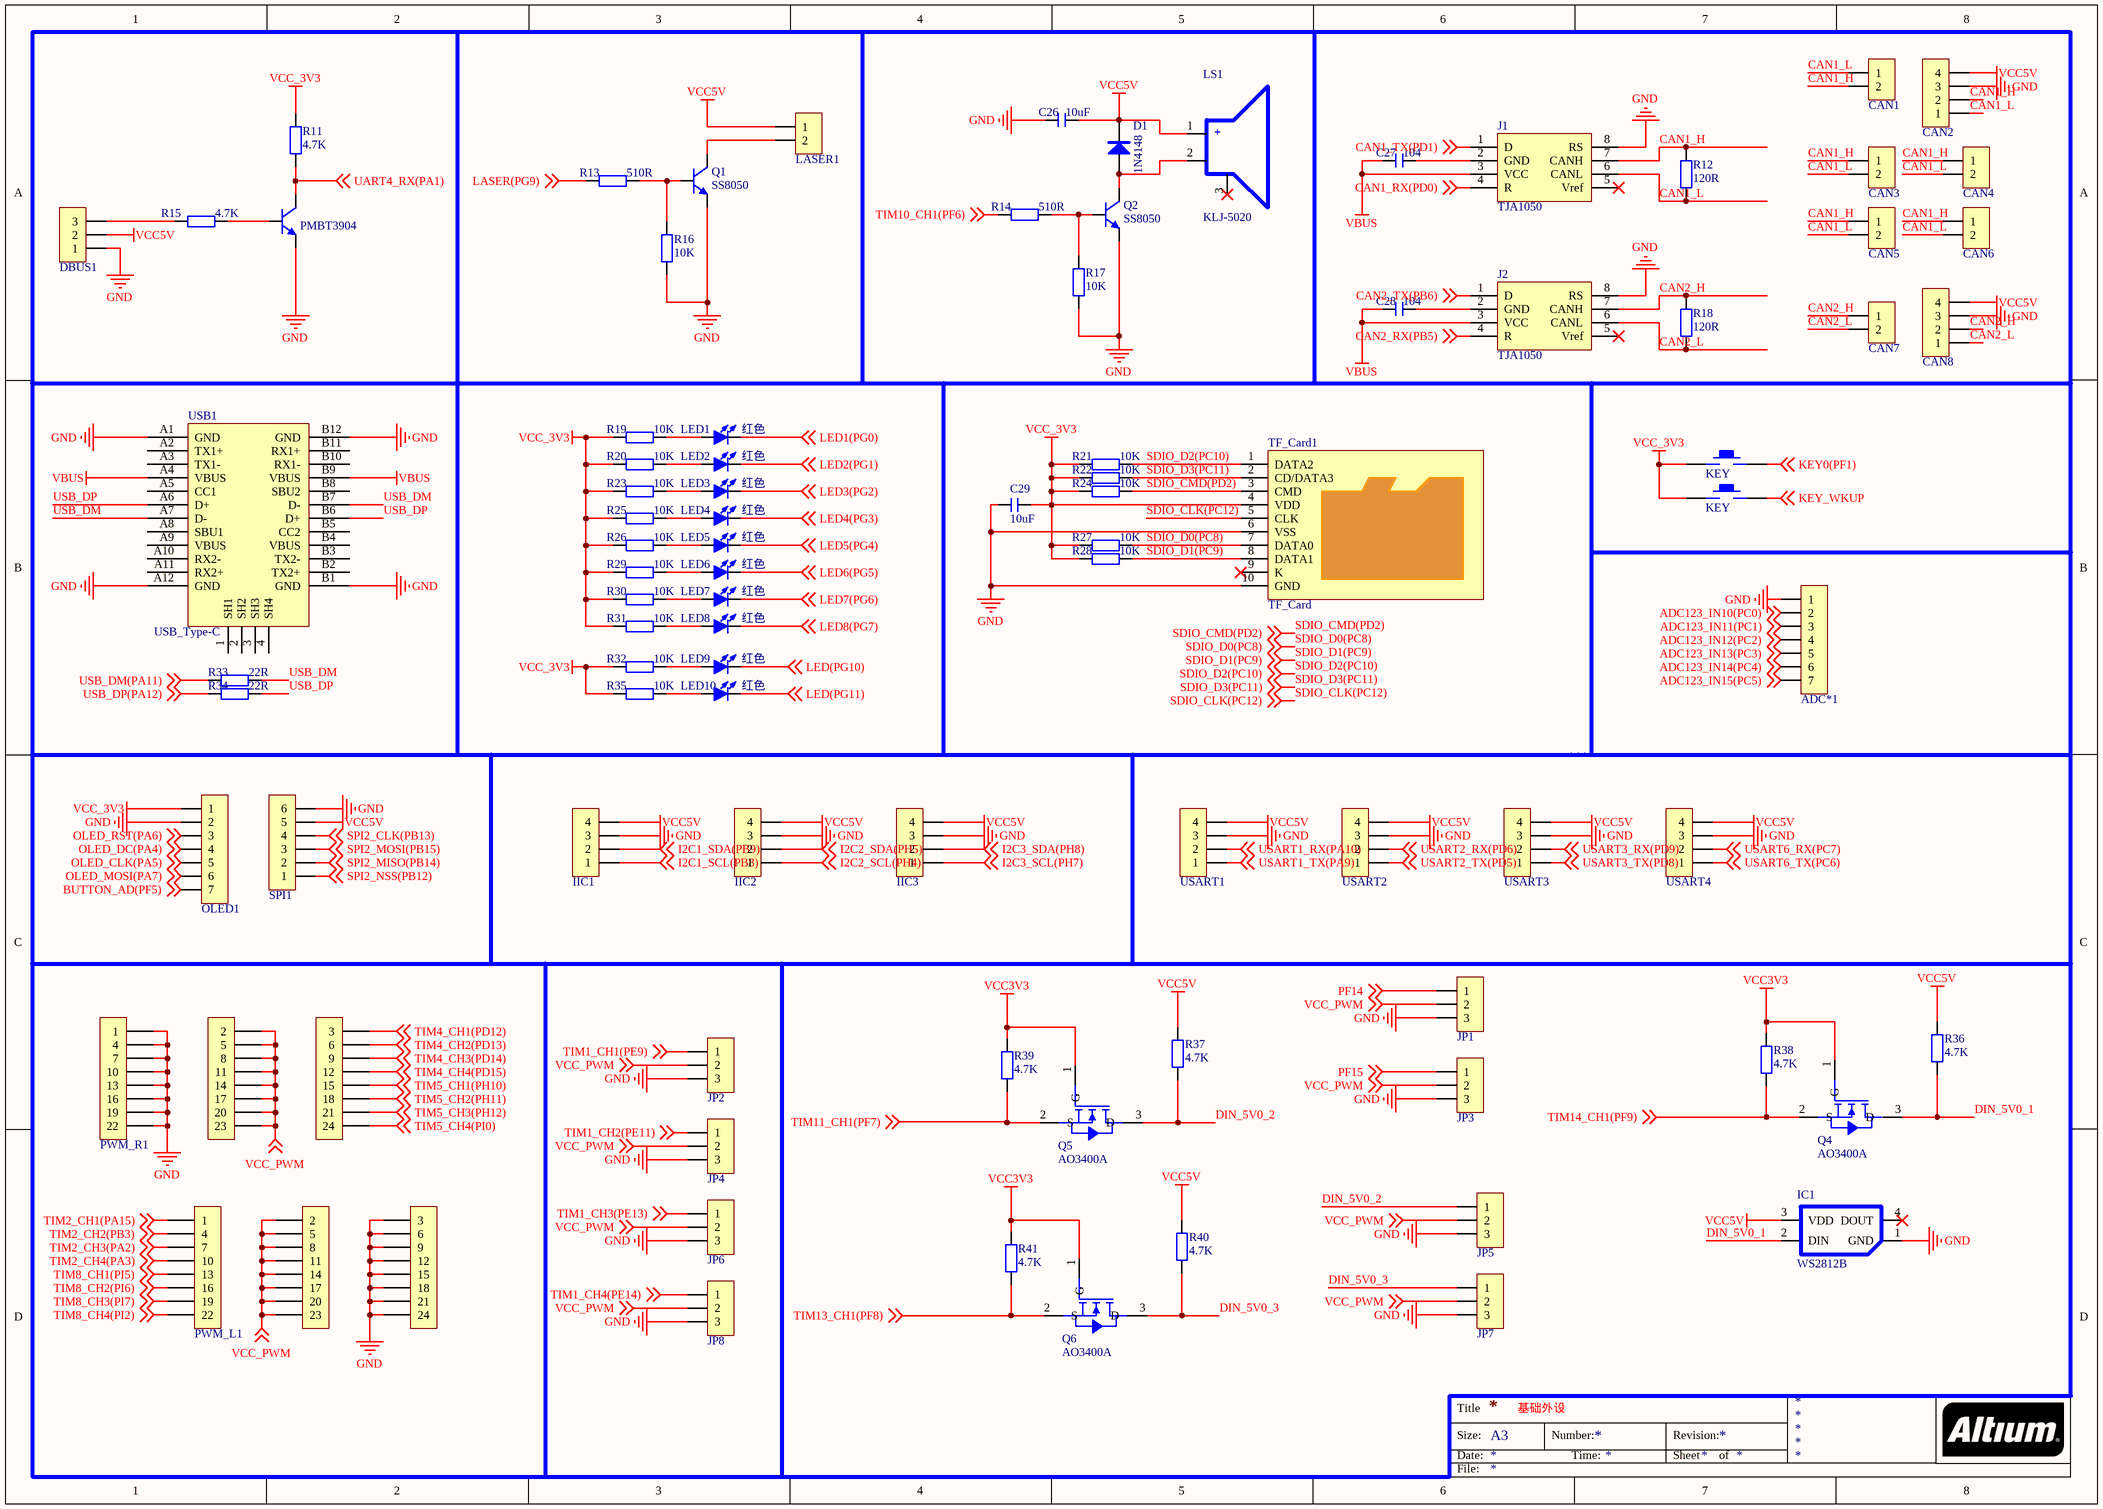
[diagram p2: BasicPeripherals.SchDoc]

### Parts
ADC*1  HDR-1X7  [MX 1.25-WS-7P]  (value not drawn)
C26  10uF  [C 0402_M]
C27  104  [C 0603_L]
C28  104  [C 0603_L]
C29  10uF  [C 0402_M]
CAN1  HDR-1X2  [MX 1.25-WS-2P]  (value not drawn)
CAN2  HDR-1X4  [MX 1.25-WS-4P]  (value not drawn)
CAN3  HDR-1X2  [MX 1.25-LS-2P]  (value not drawn)
CAN4  HDR-1X2  [MX 1.25-LS-2P]  (value not drawn)
CAN5  HDR-1X2  [MX 1.25-LS-2P]  (value not drawn)
CAN6  HDR-1X2  [MX 1.25-LS-2P]  (value not drawn)
CAN7  HDR-1X2  [MX 1.25-LS-2P]  (value not drawn)
CAN8  HDR-1X4  [MX 1.25-LS-4P]  (value not drawn)
D1  1N4148  [SOD-323]
DBUS1  HDR-1X3  [HDR2.54-WS-3P]  (value not drawn)
IC1  WS2812B  [LED 3528-4Pin]
IIC1  HDR-1X4  [MX 1.25-LS-4P]  (value not drawn)
IIC2  HDR-1X4  [MX 1.25-LS-4P]  (value not drawn)
IIC3  HDR-1X4  [MX 1.25-LS-4P]  (value not drawn)
J1  TJA1050  [SOIC-8_150mil]
J2  TJA1050  [SOIC-8_150mil]
JP1  HDR-1X3  [HDR2.54-LI-3P]  (value not drawn)
JP2  HDR-1X3  [HDR2.54-LI-3P]  (value not drawn)
JP3  HDR-1X3  [HDR2.54-LI-3P]  (value not drawn)
JP4  HDR-1X3  [HDR2.54-LI-3P]  (value not drawn)
JP5  HDR-1X3  [HDR2.54-LI-3P]  (value not drawn)
JP6  HDR-1X3  [HDR2.54-LI-3P]  (value not drawn)
JP7  HDR-1X3  [HDR2.54-LI-3P]  (value not drawn)
JP8  HDR-1X3  [HDR2.54-LI-3P]  (value not drawn)
LASER1  HDR-1X2  [MX 1.25-LS-2P]  (value not drawn)
LED1  红色  [LED 0805G]
LED2  红色  [LED 0805G]
LED3  红色  [LED 0805G]
LED4  红色  [LED 0805G]
LED5  红色  [LED 0805G]
LED6  红色  [LED 0805G]
LED7  红色  [LED 0805G]
LED8  红色  [LED 0805G]
LED9  红色  [LED 0805R]
LED10  红色  [LED 0805R]
LS1  KLJ-5020  [BUZ-SMD_4P-L5.0-W5.0-P3.80-TL]
OLED1  HDR-1X7  [MX 1.25-WS-7P]  (value not drawn)
PWM_L1  HDR3*8-left  [PIN-3*8-2.54 - duplicate]  (value not drawn)
PWM_R1  HDR3*8-right  [PIN-3*8-2.54 - duplicate]  (value not drawn)
Q1  SS8050  [SOT23-3L]
Q2  SS8050  [SOT23-3L]
Q3  PMBT3904  [SOT-23-3]
Q4  AO3400A  [SOT-23-3_L2.9-W1.3-P1.90-LS2.4-BR]
Q5  AO3400A  [SOT-23-3_L2.9-W1.3-P1.90-LS2.4-BR]
Q6  AO3400A  [SOT-23-3_L2.9-W1.3-P1.90-LS2.4-BR]
R11  4.7K  [R 0402_M]
R12  120R  [R 0402_M]
R13  510R  [R 0402_M]
R14  510R  [R 0402_M]
R15  4.7K  [R 0402_M]
R16  10K  [R 0402_M]
R17  10K  [R 0402_M]
R18  120R  [R 0402_M]
R19  10K  [R 0402_M]
R20  10K  [R 0402_M]
R21  10K  [R 0402_M]
R22  10K  [R 0402_M]
R23  10K  [R 0402_M]
R24  10K  [R 0402_M]
R25  10K  [R 0402_M]
R26  10K  [R 0402_M]
R27  10K  [R 0402_M]
R28  10K  [R 0402_M]
R29  10K  [R 0402_M]
R30  10K  [R 0402_M]
R31  10K  [R 0402_M]
R32  10K  [R 0402_M]
R33  22R  [R 0402_M]
R34  22R  [R 0402_M]
R35  10K  [R 0402_M]
R36  4.7K  [R 0402_M]
R37  4.7K  [R 0402_M]
R38  4.7K  [R 0402_M]
R39  4.7K  [R 0402_M]
R40  4.7K  [R 0402_M]
R41  4.7K  [R 0402_M]
RST2  KEY  [SMD-3.2*4.2]
RST3  KEY  [SMD-3.2*4.2]
SPI1  HDR-1X6  [MX 1.25-LS-6P]  (value not drawn)
TF_Card1  TF_Card  [Micro SD]
USART1  HDR-1X4  [MX 1.25-LS-4P]  (value not drawn)
USART2  HDR-1X4  [MX 1.25-LS-4P]  (value not drawn)
USART3  HDR-1X4  [MX 1.25-LS-4P]  (value not drawn)
USART4  HDR-1X4  [MX 1.25-LS-4P]  (value not drawn)
USB1  USB_Type-C  [Type-C-TOP]

### Nets
GND: ADC*1.1 C26.2 C29.1 CAN2.3 CAN8.3 DBUS1.1 IC1.1(GND) IIC1.3 IIC2.3 IIC3.3 J1.8(RS) J2.8(RS) JP1.3 JP2.3 JP3.3 JP4.3 JP5.3 JP6.3 JP7.3 JP8.3 OLED1.2 PWM_L1.3 PWM_L1.6 PWM_L1.9 PWM_L1.12 PWM_L1.15 PWM_L1.18 PWM_L1.21 PWM_L1.24 PWM_R1.1 PWM_R1.4 PWM_R1.7 PWM_R1.10 PWM_R1.13 PWM_R1.16 PWM_R1.19 PWM_R1.22 Q1.2(E) Q2.2(E) Q3.2(E) R16.1 R17.1 SPI1.6 TF_Card1.6(VSS) TF_Card1.10(GND) USART1.3 USART2.3 USART3.3 USART4.3 USB1.A1(GND) USB1.A12(GND) USB1.B1(GND) USB1.B12(GND)
VBUS: C27.2 C28.2 J1.3(VCC) J2.3(VCC) USB1.A4(VBUS) USB1.B9(VBUS)
VCC3V3: Q4.1(G) Q5.1(G) Q6.1(G) R38.1 R39.1 R41.1
VCC5V: C26.1 CAN2.4 CAN8.4 D1.2(K) DBUS1.2 IC1.3(VDD) IIC1.4 IIC2.4 IIC3.4 LASER1.1 LS1.1 R36.1 R37.1 R40.1 SPI1.5 USART1.4 USART2.4 USART3.4 USART4.4
VCC_3V3: C29.2 OLED1.1 R11.2 R19.1 R20.1 R21.1 R22.1 R23.1 R24.1 R25.1 R26.1 R27.1 R28.1 R29.1 R30.1 R31.1 R32.1 R35.1 RST2.1 RST3.1 TF_Card1.4(VDD)
VCC_PWM: JP1.2 JP2.2 JP3.2 JP4.2 JP5.2 JP6.2 JP7.2 JP8.2 PWM_L1.2 PWM_L1.5 PWM_L1.8 PWM_L1.11 PWM_L1.14 PWM_L1.17 PWM_L1.20 PWM_L1.23 PWM_R1.2 PWM_R1.5 PWM_R1.8 PWM_R1.11 PWM_R1.14 PWM_R1.17 PWM_R1.20 PWM_R1.23 ; off-sheet VCC_PWM  [project net VCC5V_4A]
ADC123_IN10(PC0): ADC*1.2 ; off-sheet ADC123_IN10(PC0)
ADC123_IN11(PC1): ADC*1.3 ; off-sheet ADC123_IN11(PC1)
ADC123_IN12(PC2): ADC*1.4 ; off-sheet ADC123_IN12(PC2)
ADC123_IN13(PC3): ADC*1.5 ; off-sheet ADC123_IN13(PC3)
ADC123_IN14(PC4): ADC*1.6 ; off-sheet ADC123_IN14(PC4)
ADC123_IN15(PC5): ADC*1.7 ; off-sheet ADC123_IN15(PC5)
BUTTON_AD(PF5): OLED1.7 ; off-sheet BUTTON_AD(PF5)
CAN1_H: CAN1.2 CAN2.2 CAN3.1 CAN4.1 CAN5.1 CAN6.1 J1.7(CANH) R12.2
CAN1_L: CAN1.1 CAN2.1 CAN3.2 CAN4.2 CAN5.2 CAN6.2 J1.6(CANL) R12.1
CAN1_RX(PD0): J1.4(R) ; off-sheet CAN1_RX(PD0)
CAN1_TX(PD1): J1.1(D) ; off-sheet CAN1_TX(PD1)
CAN2_H: CAN7.1 CAN8.2 J2.7(CANH) R18.2
CAN2_L: CAN7.2 CAN8.1 J2.6(CANL) R18.1
CAN2_RX(PB5): J2.4(R) ; off-sheet CAN2_RX(PB5)
CAN2_TX(PB6): J2.1(D) ; off-sheet CAN2_TX(PB6)
DIN_5V0_1: IC1.2(DIN) Q4.3(D) R36.2
DIN_5V0_2: JP5.1 Q5.3(D) R37.2
DIN_5V0_3: JP7.1 Q6.3(D) R40.2
I2C1_SCL(PB8): IIC1.1 ; off-sheet I2C1_SCL(PB8)
I2C1_SDA(PB9): IIC1.2 ; off-sheet I2C1_SDA(PB9)
I2C2_SCL(PH4): IIC2.1 ; off-sheet I2C2_SCL(PH4)
I2C2_SDA(PH5): IIC2.2 ; off-sheet I2C2_SDA(PH5)
I2C3_SCL(PH7): IIC3.1 ; off-sheet I2C3_SCL(PH7)
I2C3_SDA(PH8): IIC3.2 ; off-sheet I2C3_SDA(PH8)
KEY0(PF1): RST2.2 ; off-sheet KEY0(PF1)
KEY_WKUP: RST3.2 ; off-sheet KEY_WKUP
LASER(PG9): R13.1 ; off-sheet LASER(PG9)
LED1(PG0): LED1.2(K) ; off-sheet LED1(PG0)
LED2(PG1): LED2.2(K) ; off-sheet LED2(PG1)
LED3(PG2): LED3.2(K) ; off-sheet LED3(PG2)
LED4(PG3): LED4.2(K) ; off-sheet LED4(PG3)
LED5(PG4): LED5.2(K) ; off-sheet LED5(PG4)
LED6(PG5): LED6.2(K) ; off-sheet LED6(PG5)
LED7(PG6): LED7.2(K) ; off-sheet LED7(PG6)
LED8(PG7): LED8.2(K) ; off-sheet LED8(PG7)
LED(PG10): LED9.2(K) ; off-sheet LED(PG10)
LED(PG11): LED10.2(K) ; off-sheet LED(PG11)
OLED_CLK(PA5): OLED1.5 ; off-sheet OLED_CLK(PA5)
OLED_DC(PA4): OLED1.4 ; off-sheet OLED_DC(PA4)
OLED_MOSI(PA7): OLED1.6 ; off-sheet OLED_MOSI(PA7)
OLED_RST(PA6): OLED1.3 ; off-sheet OLED_RST(PA6)
PF14: JP1.1 ; off-sheet PF14
PF15: JP3.1 ; off-sheet PF15
SDIO_CLK(PC12): TF_Card1.5(CLK) ; off-sheet SDIO_CLK(PC12)
SDIO_CMD(PD2): R24.2 TF_Card1.3(CMD) ; off-sheet SDIO_CMD(PD2)
SDIO_D0(PC8): R27.2 TF_Card1.7(DATA0) ; off-sheet SDIO_D0(PC8)
SDIO_D1(PC9): R28.2 TF_Card1.8(DATA1) ; off-sheet SDIO_D1(PC9)
SDIO_D2(PC10): R21.2 TF_Card1.1(DATA2) ; off-sheet SDIO_D2(PC10)
SDIO_D3(PC11): R22.2 TF_Card1.2(CD/DATA3) ; off-sheet SDIO_D3(PC11)
SPI2_CLK(PB13): SPI1.4 ; off-sheet SPI2_CLK(PB13)
SPI2_MISO(PB14): SPI1.2 ; off-sheet SPI2_MISO(PB14)
SPI2_MOSI(PB15): SPI1.3 ; off-sheet SPI2_MOSI(PB15)
SPI2_NSS(PB12): SPI1.1 ; off-sheet SPI2_NSS(PB12)
TIM1_CH1(PE9): JP2.1 ; off-sheet TIM1_CH1(PE9)
TIM1_CH2(PE11): JP4.1 ; off-sheet TIM1_CH2(PE11)
TIM1_CH3(PE13): JP6.1 ; off-sheet TIM1_CH3(PE13)
TIM1_CH4(PE14): JP8.1 ; off-sheet TIM1_CH4(PE14)
TIM2_CH1(PA15): PWM_L1.1 ; off-sheet TIM2_CH1(PA15)
TIM2_CH2(PB3): PWM_L1.4 ; off-sheet TIM2_CH2(PB3)
TIM2_CH3(PA2): PWM_L1.7 ; off-sheet TIM2_CH3(PA2)
TIM2_CH4(PA3): PWM_L1.10 ; off-sheet TIM2_CH4(PA3)
TIM4_CH1(PD12): PWM_R1.3 ; off-sheet TIM4_CH1(PD12)
TIM4_CH2(PD13): PWM_R1.6 ; off-sheet TIM4_CH2(PD13)
TIM4_CH3(PD14): PWM_R1.9 ; off-sheet TIM4_CH3(PD14)
TIM4_CH4(PD15): PWM_R1.12 ; off-sheet TIM4_CH4(PD15)
TIM5_CH1(PH10): PWM_R1.15 ; off-sheet TIM5_CH1(PH10)
TIM5_CH2(PH11): PWM_R1.18 ; off-sheet TIM5_CH2(PH11)
TIM5_CH3(PH12): PWM_R1.21 ; off-sheet TIM5_CH3(PH12)
TIM5_CH4(PI0): PWM_R1.24 ; off-sheet TIM5_CH4(PI0)
TIM8_CH1(PI5): PWM_L1.13 ; off-sheet TIM8_CH1(PI5)
TIM8_CH2(PI6): PWM_L1.16 ; off-sheet TIM8_CH2(PI6)
TIM8_CH3(PI7): PWM_L1.19 ; off-sheet TIM8_CH3(PI7)
TIM8_CH4(PI2): PWM_L1.22 ; off-sheet TIM8_CH4(PI2)
TIM10_CH1(PF6): R14.1 ; off-sheet TIM10_CH1(PF6)
TIM11_CH1(PF7): Q5.2(S) R39.2 ; off-sheet TIM11_CH1(PF7)
TIM13_CH1(PF8): Q6.2(S) R41.2 ; off-sheet TIM13_CH1(PF8)
TIM14_CH1(PF9): Q4.2(S) R38.2 ; off-sheet TIM14_CH1(PF9)
UART4_RX(PA1): Q3.3(C) R11.1 ; off-sheet UART4_RX(PA1)
USART1_RX(PA10): USART1.2 ; off-sheet USART1_RX(PA10)
USART1_TX(PA9): USART1.1 ; off-sheet USART1_TX(PA9)
USART2_RX(PD6): USART2.2 ; off-sheet USART2_RX(PD6)
USART2_TX(PD5): USART2.1 ; off-sheet USART2_TX(PD5)
USART3_RX(PD9): USART3.2 ; off-sheet USART3_RX(PD9)
USART3_TX(PD8): USART3.1 ; off-sheet USART3_TX(PD8)
USART6_RX(PC7): USART4.2 ; off-sheet USART6_RX(PC7)
USART6_TX(PC6): USART4.1 ; off-sheet USART6_TX(PC6)
USB_DM: R33.2 USB1.A7(D-) USB1.B7(D-)
USB_DM(PA11): R33.1 ; off-sheet USB_DM(PA11)
USB_DP: R34.2 USB1.A6(D+) USB1.B6(D+)
USB_DP(PA12): R34.1 ; off-sheet USB_DP(PA12)
NetC27_1: C27.1 J1.2(GND)
NetC28_1: C28.1 J2.2(GND)
NetD1_1: D1.1(A) LS1.2 Q2.3(C)
NetDBUS1_3: DBUS1.3 R15.2
NetLASER1_2: LASER1.2 Q1.3(C)
NetLED1_1: LED1.1(A) R19.2
NetLED2_1: LED2.1(A) R20.2
NetLED3_1: LED3.1(A) R23.2
NetLED4_1: LED4.1(A) R25.2
NetLED5_1: LED5.1(A) R26.2
NetLED6_1: LED6.1(A) R29.2
NetLED7_1: LED7.1(A) R30.2
NetLED8_1: LED8.1(A) R31.2
NetLED9_1: LED9.1(A) R32.2
NetLED10_1: LED10.1(A) R35.2
NetQ1_1: Q1.1(B) R13.2 R16.2
NetQ2_1: Q2.1(B) R14.2 R17.2
NetQ3_1: Q3.1(B) R15.1

Not connected (* = marked no-connect by the designer): IC1 4(DOUT)*; J1 5(Vref)*; J2 5(Vref)*; LS1 3*; TF_Card1 9(K)*; USB1 1(SH1) 2(SH2) 3(SH3) 4(SH4) A2(TX1+) A3(TX1-) A5(CC1) A8(SBU1) A9(VBUS) A10(RX2-) A11(RX2+) B2(TX2+) B3(TX2-) B4(VBUS) B5(CC2) B8(SBU2) B10(RX1-) B11(RX1+)

### Notes on the sheet
- 基础外设
- Title
- Size:
- Date:
- A3
- Number:
- Time:
- Revision:
- Sheet
- of
- File:
- (in symbol KLJ-5020) +

### Library data of the parts
ADC*1 OLED1 = Header 7: 7P接插件
C26-C29 = C: 贴片电容
CAN1 CAN3-CAN7 LASER1 = Header 2: 2P接插件
CAN2 CAN8 IIC1-IIC3 USART1-USART4 = Header 4: 4P接插件
D1 = 1N4148: 开关二极管
DBUS1 JP1-JP8 = Header 3: 3P接插件
J1 J2 = TJA1050: CAN芯片
LED1-LED10 = LED-SMD: 贴片LED
LS1 = KLJ-5020: 蜂鸣器
PWM_L1 = HDR3*8-left: Connector
PWM_R1 = HDR3*8-right: Connector
Q1 Q2 = 8050-SMD: 高频放大-NPN型
Q3 = PMBT3904: NPN Bipolar Transistor
R11-R41 = R: 贴片电阻
RST2 RST3 = KEY_M
SPI1 = Header 6: 6P接插件
TF_Card1 = TF_Card: TF卡座

## Nets that join several sheets
GND: Power (12 pins), STM32F407IGH6BGA (70 pins), BasicPeripherals (53 pins)
VCC3V3: Power (C55.2 C57.2 U3.5), STM32F407IGH6BGA (39 pins), BasicPeripherals (6 pins)
VCC5V: Power (9 pins), BasicPeripherals (19 pins)
VCC5V_4A: Power (8 pins), BasicPeripherals (24 pins)
VCC_3V3: STM32F407IGH6BGA (SW1.4), BasicPeripherals (21 pins)
ADC123_IN10(PC0): STM32F407IGH6BGA (U1.M2), BasicPeripherals (ADC*1.2)
ADC123_IN11(PC1): STM32F407IGH6BGA (U1.M3), BasicPeripherals (ADC*1.3)
ADC123_IN12(PC2): STM32F407IGH6BGA (U1.M4), BasicPeripherals (ADC*1.4)
ADC123_IN13(PC3): STM32F407IGH6BGA (U1.M5), BasicPeripherals (ADC*1.5)
ADC123_IN14(PC4): STM32F407IGH6BGA (U1.N5), BasicPeripherals (ADC*1.6)
ADC123_IN15(PC5): STM32F407IGH6BGA (U1.P5), BasicPeripherals (ADC*1.7)
BUTTON_AD(PF5): STM32F407IGH6BGA (U1.K3), BasicPeripherals (OLED1.7)
CAN1_RX(PD0): STM32F407IGH6BGA (U1.B12), BasicPeripherals (J1.4)
CAN1_TX(PD1): STM32F407IGH6BGA (U1.C12), BasicPeripherals (J1.1)
CAN2_RX(PB5): STM32F407IGH6BGA (U1.A6), BasicPeripherals (J2.4)
CAN2_TX(PB6): STM32F407IGH6BGA (U1.B6), BasicPeripherals (J2.1)
I2C1_SCL(PB8): STM32F407IGH6BGA (U1.A5), BasicPeripherals (IIC1.1)
I2C1_SDA(PB9): STM32F407IGH6BGA (U1.B4), BasicPeripherals (IIC1.2)
I2C2_SCL(PH4): STM32F407IGH6BGA (U1.H4), BasicPeripherals (IIC2.1)
I2C2_SDA(PH5): STM32F407IGH6BGA (U1.J4), BasicPeripherals (IIC2.2)
I2C3_SCL(PH7): STM32F407IGH6BGA (U1.N12), BasicPeripherals (IIC3.1)
I2C3_SDA(PH8): STM32F407IGH6BGA (U1.M12), BasicPeripherals (IIC3.2)
KEY0(PF1): STM32F407IGH6BGA (U1.H3), BasicPeripherals (RST2.2)
KEY_WKUP: STM32F407IGH6BGA (U1.N3), BasicPeripherals (RST3.2)
LASER(PG9): STM32F407IGH6BGA (U1.C10), BasicPeripherals (R13.1)
LED1(PG0): STM32F407IGH6BGA (U1.N7), BasicPeripherals (LED1.2)
LED2(PG1): STM32F407IGH6BGA (U1.M7), BasicPeripherals (LED2.2)
LED3(PG2): STM32F407IGH6BGA (U1.L15), BasicPeripherals (LED3.2)
LED4(PG3): STM32F407IGH6BGA (U1.K15), BasicPeripherals (LED4.2)
LED5(PG4): STM32F407IGH6BGA (U1.K14), BasicPeripherals (LED5.2)
LED6(PG5): STM32F407IGH6BGA (U1.K13), BasicPeripherals (LED6.2)
LED7(PG6): STM32F407IGH6BGA (U1.J15), BasicPeripherals (LED7.2)
LED8(PG7): STM32F407IGH6BGA (U1.J14), BasicPeripherals (LED8.2)
LED(PG10): STM32F407IGH6BGA (U1.B10), BasicPeripherals (LED9.2)
LED(PG11): STM32F407IGH6BGA (U1.B9), BasicPeripherals (LED10.2)
OLED_CLK(PA5): STM32F407IGH6BGA (U1.P4), BasicPeripherals (OLED1.5)
OLED_DC(PA4): STM32F407IGH6BGA (U1.N4), BasicPeripherals (OLED1.4)
OLED_MOSI(PA7): STM32F407IGH6BGA (U1.R3), BasicPeripherals (OLED1.6)
OLED_RST(PA6): STM32F407IGH6BGA (U1.P3), BasicPeripherals (OLED1.3)
PF14: STM32F407IGH6BGA (U1.R7), BasicPeripherals (JP1.1)
PF15: STM32F407IGH6BGA (U1.P7), BasicPeripherals (JP3.1)
SDIO_CLK(PC12): STM32F407IGH6BGA (U1.A12), BasicPeripherals (TF_Card1.5)
SDIO_CMD(PD2): STM32F407IGH6BGA (U1.D12), BasicPeripherals (R24.2 TF_Card1.3)
SDIO_D0(PC8): STM32F407IGH6BGA (U1.G14), BasicPeripherals (R27.2 TF_Card1.7)
SDIO_D1(PC9): STM32F407IGH6BGA (U1.F14), BasicPeripherals (R28.2 TF_Card1.8)
SDIO_D2(PC10): STM32F407IGH6BGA (U1.B14), BasicPeripherals (R21.2 TF_Card1.1)
SDIO_D3(PC11): STM32F407IGH6BGA (U1.B13), BasicPeripherals (R22.2 TF_Card1.2)
SPI2_CLK(PB13): STM32F407IGH6BGA (U1.P13), BasicPeripherals (SPI1.4)
SPI2_MISO(PB14): STM32F407IGH6BGA (U1.R14), BasicPeripherals (SPI1.2)
SPI2_MOSI(PB15): STM32F407IGH6BGA (U1.R15), BasicPeripherals (SPI1.3)
SPI2_NSS(PB12): STM32F407IGH6BGA (U1.P12), BasicPeripherals (SPI1.1)
TIM1_CH1(PE9): STM32F407IGH6BGA (U1.P9), BasicPeripherals (JP2.1)
TIM1_CH2(PE11): STM32F407IGH6BGA (U1.P10), BasicPeripherals (JP4.1)
TIM1_CH3(PE13): STM32F407IGH6BGA (U1.N11), BasicPeripherals (JP6.1)
TIM1_CH4(PE14): STM32F407IGH6BGA (U1.P11), BasicPeripherals (JP8.1)
TIM2_CH1(PA15): STM32F407IGH6BGA (U1.A13), BasicPeripherals (PWM_L1.1)
TIM2_CH2(PB3): STM32F407IGH6BGA (U1.A10), BasicPeripherals (PWM_L1.4)
TIM2_CH3(PA2): STM32F407IGH6BGA (U1.P2), BasicPeripherals (PWM_L1.7)
TIM2_CH4(PA3): STM32F407IGH6BGA (U1.R2), BasicPeripherals (PWM_L1.10)
TIM4_CH1(PD12): STM32F407IGH6BGA (U1.N13), BasicPeripherals (PWM_R1.3)
TIM4_CH2(PD13): STM32F407IGH6BGA (U1.M15), BasicPeripherals (PWM_R1.6)
TIM4_CH3(PD14): STM32F407IGH6BGA (U1.M14), BasicPeripherals (PWM_R1.9)
TIM4_CH4(PD15): STM32F407IGH6BGA (U1.L14), BasicPeripherals (PWM_R1.12)
TIM5_CH1(PH10): STM32F407IGH6BGA (U1.L13), BasicPeripherals (PWM_R1.15)
TIM5_CH2(PH11): STM32F407IGH6BGA (U1.L12), BasicPeripherals (PWM_R1.18)
TIM5_CH3(PH12): STM32F407IGH6BGA (U1.K12), BasicPeripherals (PWM_R1.21)
TIM5_CH4(PI0): STM32F407IGH6BGA (U1.E14), BasicPeripherals (PWM_R1.24)
TIM8_CH1(PI5): STM32F407IGH6BGA (U1.C4), BasicPeripherals (PWM_L1.13)
TIM8_CH2(PI6): STM32F407IGH6BGA (U1.C3), BasicPeripherals (PWM_L1.16)
TIM8_CH3(PI7): STM32F407IGH6BGA (U1.C2), BasicPeripherals (PWM_L1.19)
TIM8_CH4(PI2): STM32F407IGH6BGA (U1.C14), BasicPeripherals (PWM_L1.22)
TIM10_CH1(PF6): STM32F407IGH6BGA (U1.K2), BasicPeripherals (R14.1)
TIM11_CH1(PF7): STM32F407IGH6BGA (U1.K1), BasicPeripherals (Q5.2 R39.2)
TIM13_CH1(PF8): STM32F407IGH6BGA (U1.L3), BasicPeripherals (Q6.2 R41.2)
TIM14_CH1(PF9): STM32F407IGH6BGA (U1.L2), BasicPeripherals (Q4.2 R38.2)
UART4_RX(PA1): STM32F407IGH6BGA (U1.N2), BasicPeripherals (Q3.3 R11.1)
USART1_RX(PA10): STM32F407IGH6BGA (U1.D15), BasicPeripherals (USART1.2)
USART1_TX(PA9): STM32F407IGH6BGA (U1.E15), BasicPeripherals (USART1.1)
USART2_RX(PD6): STM32F407IGH6BGA (U1.B11), BasicPeripherals (USART2.2)
USART2_TX(PD5): STM32F407IGH6BGA (U1.C11), BasicPeripherals (USART2.1)
USART3_RX(PD9): STM32F407IGH6BGA (U1.P14), BasicPeripherals (USART3.2)
USART3_TX(PD8): STM32F407IGH6BGA (U1.P15), BasicPeripherals (USART3.1)
USART6_RX(PC7): STM32F407IGH6BGA (U1.G15), BasicPeripherals (USART4.2)
USART6_TX(PC6): STM32F407IGH6BGA (U1.H15), BasicPeripherals (USART4.1)
USB_DM(PA11): STM32F407IGH6BGA (U1.C15), BasicPeripherals (R33.1)
USB_DP(PA12): STM32F407IGH6BGA (U1.B15), BasicPeripherals (R34.1)